# EAGLE design Zeppelin (EAGLE 9.4.2)
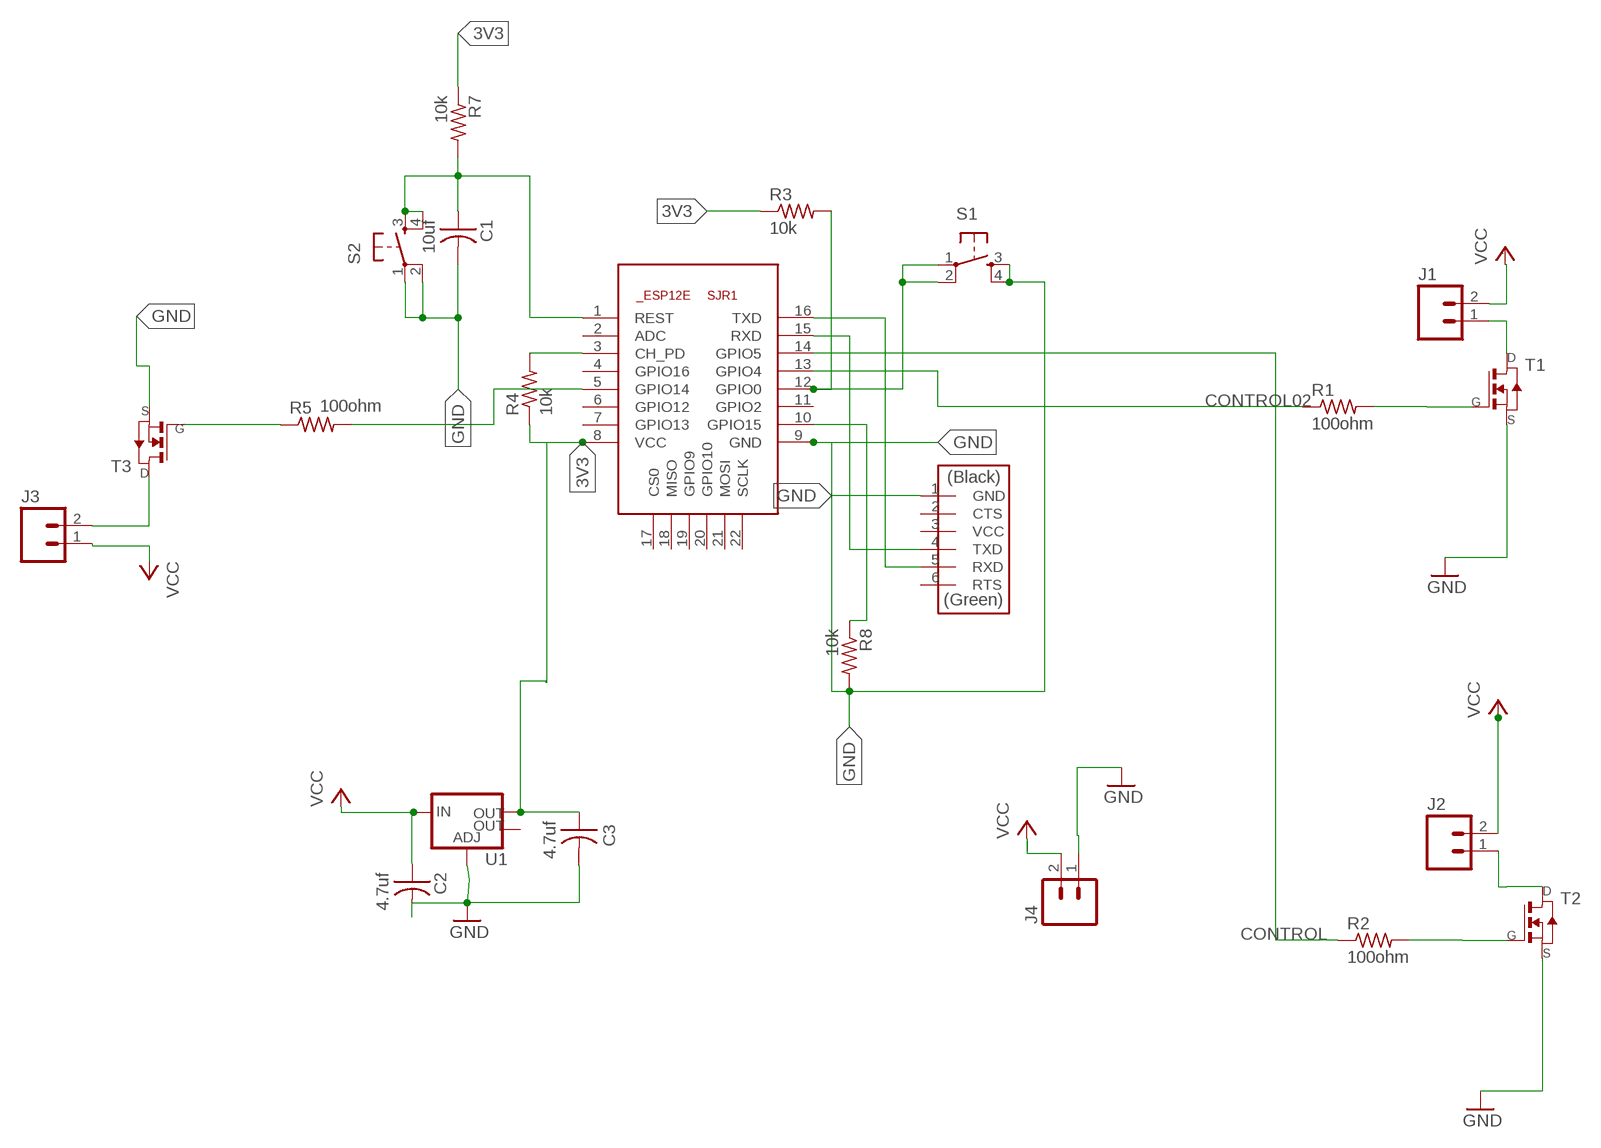
[diagram p0: schematic, sheet 1]

## Parts
C1  10uf  CAP-US1206FAB  [C1206FAB]
C2  4.7uf  CAP-US1206FAB  [C1206FAB]
C3  4.7uf  CAP-US1206FAB  [C1206FAB]
J1  M02POLAR_LOCK  [MOLEX-1X2_LOCK]
J2  M02POLAR_LOCK  [MOLEX-1X2_LOCK]
J3  M02POLAR_LOCK  [MOLEX-1X2_LOCK]
J4  M02POLAR_LOCK  [MOLEX-1X2_LOCK]
R1  100ohm  RES-US1206FAB  [R1206FAB]
R2  100ohm  RES-US1206FAB  [R1206FAB]
R3  10k  RES-US1206FAB  [R1206FAB]
R4  10k  RES-US1206FAB  [R1206FAB]
R5  100ohm  RES-US1206FAB  [R1206FAB]
R7  10k  RES-US1206FAB  [R1206FAB]
R8  10k  RES-US1206FAB  [R1206FAB]
S1  6MM_SWITCH6MM_SWITCH  [6MM_SWITCH]
S2  6MM_SWITCH6MM_SWITCH  [6MM_SWITCH]
SJR1  ESP8266-12EESP12E  [ESP8266-ESP12E]
T1  NMOSFETSOT23  [SOT-23]
T2  NMOSFETSOT23  [SOT-23]
T3  NMOSFETSOT23  [SOT-23]
U1  V_REG_LM1117SOT223  [SOT223]
U$7  FTDI-SMD-HEADER  [1X06SMD]

## Nets
3V3: C3.1 R3.1 R4.1 R7.1 SJR1.8(VCC) U1.2(OUT)
CONTROL: R2.1 SJR1.14(GPIO5)
CONTROL02: R1.1 SJR1.13(GPIO4)
GND: C1.2 C2.2 C3.2 J4.1 R8.2 S1.3(S) S1.4(S1) S2.1(P) S2.2(P1) SJR1.9(GND) T1.2(S) T2.2(S) T3.2(S) U1.1(ADJ) U$7.1(GND)
N$1: R1.2 T1.3(G)
N$2: J1.1 T1.1(D)
N$3: SJR1.16(TXD) U$7.5(RXD)
N$4: SJR1.15(RXD) U$7.4(TXD)
N$5: R8.1 SJR1.10(GPIO15)
N$7: J3.2 T3.1(D)
N$8: R3.2 S1.1(P) S1.2(P1) SJR1.12(GPIO0)
N$9: R5.2 SJR1.5(GPIO14)
N$10: J2.1 T2.1(D)
N$11: C1.1 R7.2 S2.3(S) S2.4(S1) SJR1.1(REST)
N$12: R2.2 T2.3(G)
N$15: R4.2 SJR1.3(CH_PD)
N$17: R5.1 T3.3(G)
VCC: C2.1 J1.2 J2.2 J3.1 J4.2 U1.3(IN)
Unconnected: SJR1.2(ADC) SJR1.4(GPIO16) SJR1.6(GPIO12) SJR1.7(GPIO13) SJR1.11(GPIO2) SJR1.17(CS0) SJR1.18(MISO) SJR1.19(GPIO9) SJR1.20(GPIO10) SJR1.21(MOSI) SJR1.22(SCLK) U1.4(OUT) U$7.2(CTS) U$7.3(VCC) U$7.6(RTS)

## Library data of the parts
C1-C3 = fab:CAP-US
J1-J4 = SparkFun-Connectors:M02: Standard 2-pin 0.1" header. Use with - straight break away headers ( PRT-00116) - right angle break away headers (PRT-00553) - swiss pins (PRT-00743) - machine pins (PRT-00117) - female headers (PRT-00115) Molex polarized connector foot print use with: PRT-08233 with associated crimp pins and housings. 2.54_SCREWTERM for use with PRT-10571. 3.5mm Screw Terminal footprints for PRT-08084 5mm Screw Terminal footprints for use with PRT-08432
R1-R5 R7 R8 = fab:RES-US: Resistor (US Symbol) Variants with postfix FAB are widened to allow the routing of internal traces
S1 S2 = fab:6MM_SWITCH: OMRON SWITCH
SJR1 = esp12e:ESP8266-12E: ESP8266-12E Library for Eagle CAD The author not responsible for any damages or errors!. Created by Suhail jr.lt;/author>
T1-T3 = fab:NMOSFET: MOS FET
U1 = fab:V_REG_LM1117: Voltage Regulator LM1117 Standard adjustable voltage regulator but in SMD form. Spark Fun Electronics SKU : COM-00595; PROD_ID: VREG-08170
U$7 = fab:FTDI-SMD-HEADER

## Board
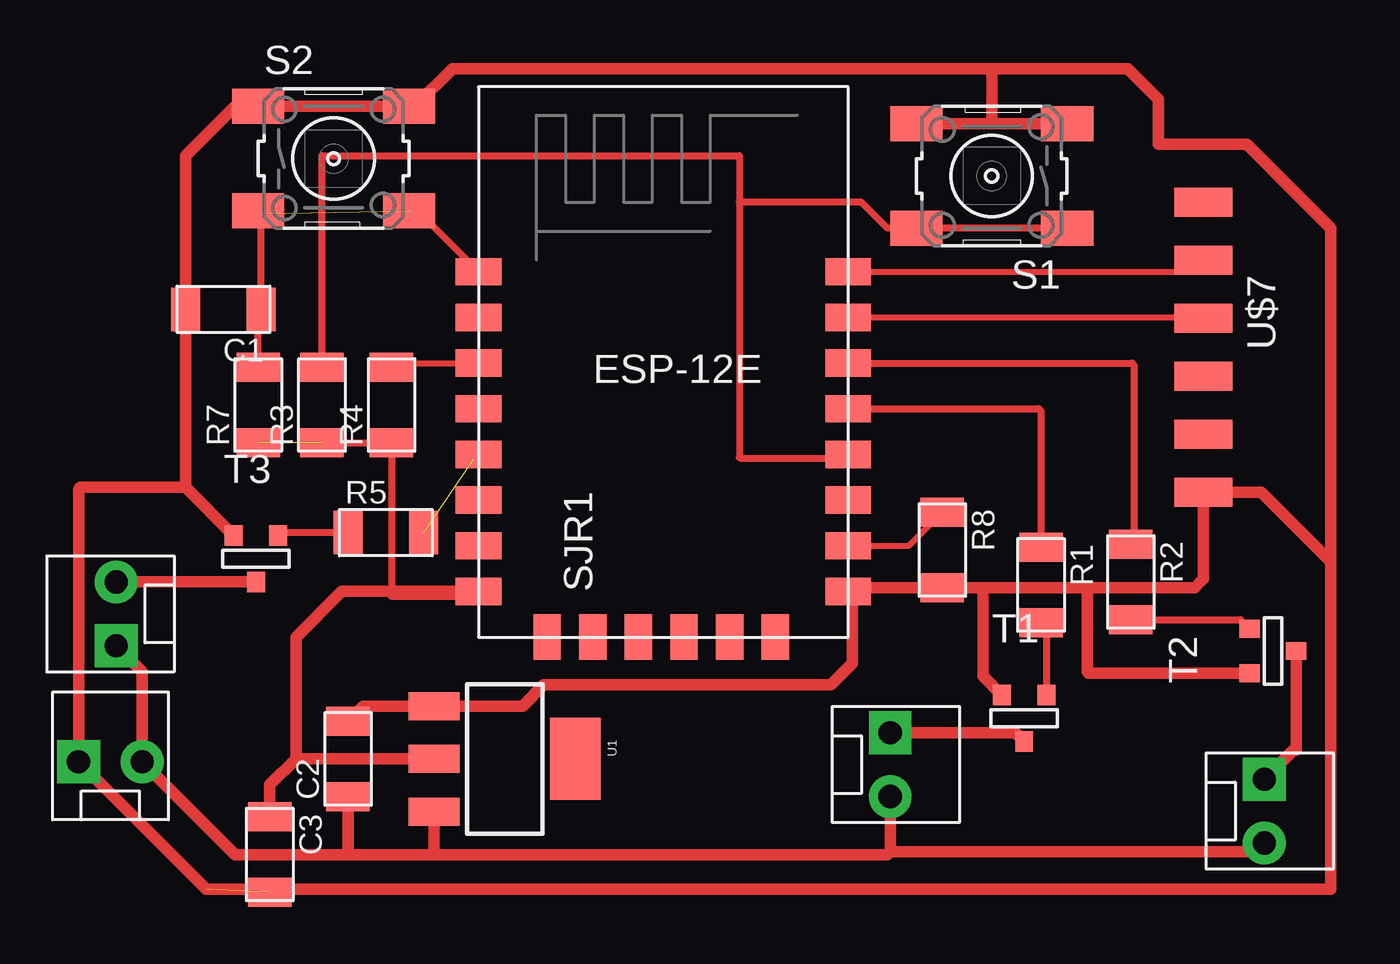
[diagram p1: board, top side]

No outline drawn. Coordinates in mm, seen from the top.
Copper layers (1*16): Top 0.035mm / dielectric 1.5mm / Bottom 0.035mm
Design rules "fabmodule": minimum track width 10mil, minimum drill 0.4mm, track to track 0.42mm, track to pad 0.42mm, pad to pad 0.42mm, via to via 0.42mm, smd to smd 0.42mm, copper to edge 40mil, drill to drill 0.8mm, minimum pad ring 10mil, minimum via ring 8mil, stop-mask expansion 4mil, vias tented up to drill 0mil, thermal gap 10mil

### Footprints (pad centres in the part's own frame; a part is rotated, then mirrored left to right if it is on the bottom)
C1206FAB = smd 1.27 x 1.905: 1 -1.651,0; 2 1.651,0
MOLEX-1X2_LOCK = drill 1.016 pad 1.88 square: 1 -0.127,0 | drill 1.016 pad 1.88: 2 2.667,0
R1206FAB = smd 1.27 x 1.905: 1 -1.651,0; 2 1.651,0
6MM_SWITCH = smd 2.286 x 1.524: 1 -3.302,2.286; 2 3.302,2.286; 3 -3.302,-2.286; 4 3.302,-2.286
ESP8266-ESP12E = smd 2 x 1.2: 1 -7.62,5.84; 2 -7.62,3.84; 3 -7.62,1.84; 4 -7.62,-0.16; 5 -7.62,-2.16; 6 -7.62,-4.16; 7 -7.62,-6.16; 8 -7.62,-8.16; 9 8.58,-8.16; 10 8.58,-6.16; 11 8.58,-4.16; 12 8.58,-2.16; 13 8.58,-0.16; 14 8.58,1.84; 15 8.58,3.84; 16 8.58,5.84 | smd 1.2 x 2: 17 -4.62,-10.16; 18 -2.62,-10.16; 19 -0.62,-10.16; 20 1.38,-10.16; 21 3.38,-10.16; 22 5.38,-10.16
SOT-23 = smd 0.787 x 0.889: 1 0.025,-1.016; 2 -0.94,1.016; 3 0.991,1.016
SOT223 = smd 1.219 x 2.235: 1 -2.311,-3.099; 2 0,-3.099; 3 2.311,-3.099 | smd 3.6 x 2.2: 4 0,3.099
1X06SMD = smd 2.54 x 1.27: 1 0,6.35; 2 0,3.81; 3 0,1.27; 4 0,-1.27; 5 0,-3.81; 6 0,-6.35

### Placement (x,y rotation side)
C1  0.25,56.26 180 top
C2  5.71,36.58 90 top
C3  2.29,32.38 270 top
J1  29.46,37.59 270 top
J2  45.85,35.56 270 top
J3  -4.45,41.66 90 top
J4  -5.97,36.45 0 top
R1  36.07,44.2 270 top
R2  40.01,44.32 270 top
R3  4.57,52.07 90 top
R4  7.62,52.07 90 top
R5  7.37,46.48 0 top
R7  1.78,52.07 90 top
R8  31.75,45.72 270 top
S1  33.91,62.1 180 top
S2  5.08,62.87 0 top
SJR1  19.05,52.07 0 top
T1  35.31,38.35 0 top
T2  46.23,41.27 90 top
T3  1.65,45.34 0 top
U1  12.57,36.58 270 top
U$7  43.18,54.61 180 top

### Tracks (layer width: path | path; a pad name or v marks a point on that pad's centre or on a via)
3V3  (1 unrouted)
  Top 0.305: R3.1 R4.1 7.62,43.69 11.21,43.69 SJR1.8
  Top 0.508: U1.2 3.43,36.58 | 3.43,36.58 3.43,41.91 5.43,43.91 SJR1.8 | C3.1 2.29,35.43 3.43,36.58
CONTROL
  Top 0.305: SJR1.14 40.07,53.91 40.13,53.85 40.13,46.1 R2.1
CONTROL02
  Top 0.305: SJR1.13 35.97,51.91 36.07,51.82 R1.1
GND  (1 unrouted)
  Top 0.254: R8.2 27.79,44.07 27.67,43.95 SJR1.9
  Top 0.305: S1.4 31.17,64.39 | 45.09,63.5 41.27,63.5 41.21,63.44 41.21,63.5 | 42.8,44.07 42.67,44.07 | 33.53,44.07 R8.2 | 43.18,44.45 43.05,44.32 | 1.02,65.15 S2.1 S2.2 8.64,65.15
  Top 0.508: T3.2 -1.4,48.46 | -1.4,48.46 C1.2 -1.4,62.99 0.76,65.15 1.02,65.15 | S2.1 8.64,65.15 | S2.2 8.51,65.28 8.76,65.28 10.29,66.8 33.91,66.8 | 33.91,66.8 39.88,66.8 41.21,65.47 41.21,63.5 45.09,63.5 48.77,59.82 48.77,45.21 | 43.18,44.45 U$7.1 45.72,48.26 48.77,45.21 | 43.05,44.32 42.8,44.07 | 42.67,44.07 38.1,44.07 | 38.1,44.07 33.53,44.07 | 33.53,44.07 27.05,44.07 26.92,44.2 27.43,44.2 27.67,43.95 27.81,43.81 27.81,40.77 26.86,39.81 14.29,39.81 13.36,38.89 U1.1 6.38,38.89 C2.2 | T1.2 33.53,40.21 33.53,44.07 | -1.4,48.46 -6.02,48.46 -6.1,48.39 J4.1 -0.51,30.86 48.77,30.86 48.77,45.21 | S1.3 33.91,64.39 | 33.91,64.39 S1.4 | 33.91,64.39 33.91,66.8 | 38.1,44.07 38.1,40.39 38.15,40.34 T2.2
N$1
  Top 0.305: R1.2 36.3,42.32 T1.3
N$2
  Top 0.508: T1.1 34.95,37.72 J1.1
N$3
  Top 0.254: SJR1.16 42.67,57.91 U$7.5
N$4
  Top 0.254: SJR1.15 43.15,55.91 U$7.4
N$5
  Top 0.254: SJR1.10 30.29,45.91 R8.1
N$7
  Top 0.508: T3.1 J3.2
N$8
  Top 0.254: 27.47,49.75 SJR1.12
  Top 0.305: 22.86,60.96 22.86,62.99 4.57,62.99 R3.2 | 22.86,60.96 22.86,49.78 22.9,49.75 27.47,49.75 | S1.1 S1.2 29.34,59.82 28.19,60.96 22.86,60.96
N$9  (1 unrouted)
  Top 0.254: SJR1.5 11.22,49.7
N$10
  Top 0.508: T2.1 47.24,36.96 47.12,36.96 J2.1
N$11  (1 unrouted)
  Top 0.305: S2.4 8.76,60.58 SJR1.1 | R7.2 1.78,56.13 C1.1 1.91,60.45 S2.3
N$12
  Top 0.254: 40.36,42.32 R2.2
  Top 0.305: R2.2 44.81,42.67 T2.3
N$15
  Top 0.254: R4.2 7.81,53.91 SJR1.3
N$17
  Top 0.305: R5.1 2.77,46.48 T3.3
VCC
  Top 0.508: J3.1 -3.3,40.39 J4.2 0.76,32.38 5.71,32.38 | 5.71,32.38 9.53,32.38 | 9.53,32.38 29.34,32.38 29.46,32.51 | J1.2 29.46,32.51 | 29.46,32.51 45.47,32.51 J2.2 | U1.3 9.47,32.44 9.53,32.38 | C2.1 5.71,32.38